# EAGLE design upromswr (EAGLE 9.6.1)
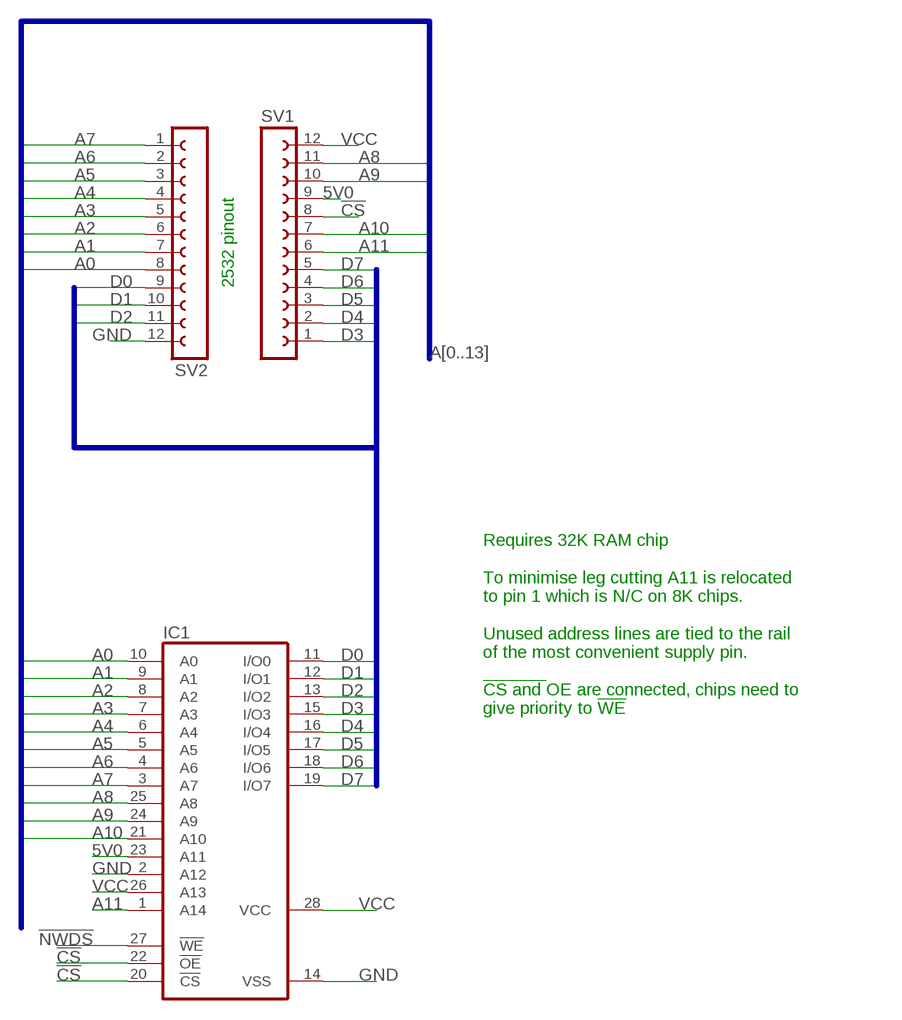
[diagram p0: schematic, sheet 1]

## Parts
IC1  62256P  [DIL28-6]
SV1  FE12-1  [FE12]
SV2  FE12-1  [FE12]

## Nets
5V0: IC1.23(A11) SV1.9
!CS: IC1.20(!CS) IC1.22(!OE) SV1.8
!NWDS: IC1.27(!WE)
A0: IC1.10(A0) SV2.8
A1: IC1.9(A1) SV2.7
A2: IC1.8(A2) SV2.6
A3: IC1.7(A3) SV2.5
A4: IC1.6(A4) SV2.4
A5: IC1.5(A5) SV2.3
A6: IC1.4(A6) SV2.2
A7: IC1.3(A7) SV2.1
A8: IC1.25(A8) SV1.11
A9: IC1.24(A9) SV1.10
A10: IC1.21(A10) SV1.7
A11: IC1.1(A14) SV1.6
D0: IC1.11(I/O0) SV2.9
D1: IC1.12(I/O1) SV2.10
D2: IC1.13(I/O2) SV2.11
D3: IC1.15(I/O3) SV1.1
D4: IC1.16(I/O4) SV1.2
D5: IC1.17(I/O5) SV1.3
D6: IC1.18(I/O6) SV1.4
D7: IC1.19(I/O7) SV1.5
GND: IC1.2(A12) IC1.14(VSS) SV2.12
VCC: IC1.26(A13) IC1.28(VCC) SV1.12

## Buses
A[0..13]
D[0..7]

## Notes on the sheet
- 2532 pinout
- Requires 32K RAM chip
  
  To minimise leg cutting A11 is relocated
  to pin 1 which is N/C on 8K chips.
  
  Unused address lines are tied to the rail
  of the most convenient supply pin.
  
  !CS and !OE are connected, chips need to
  give priority to !WE

## Library data of the parts
IC1 = memory-hitachi:62256P: MEMORY; OC_FARNELL: unknown; OC_NEWARK: unknown
SV1 SV2 = con-lsta:FE12-1: FEMALE HEADER; OC_FARNELL: unknown; OC_NEWARK: unknown

## Board
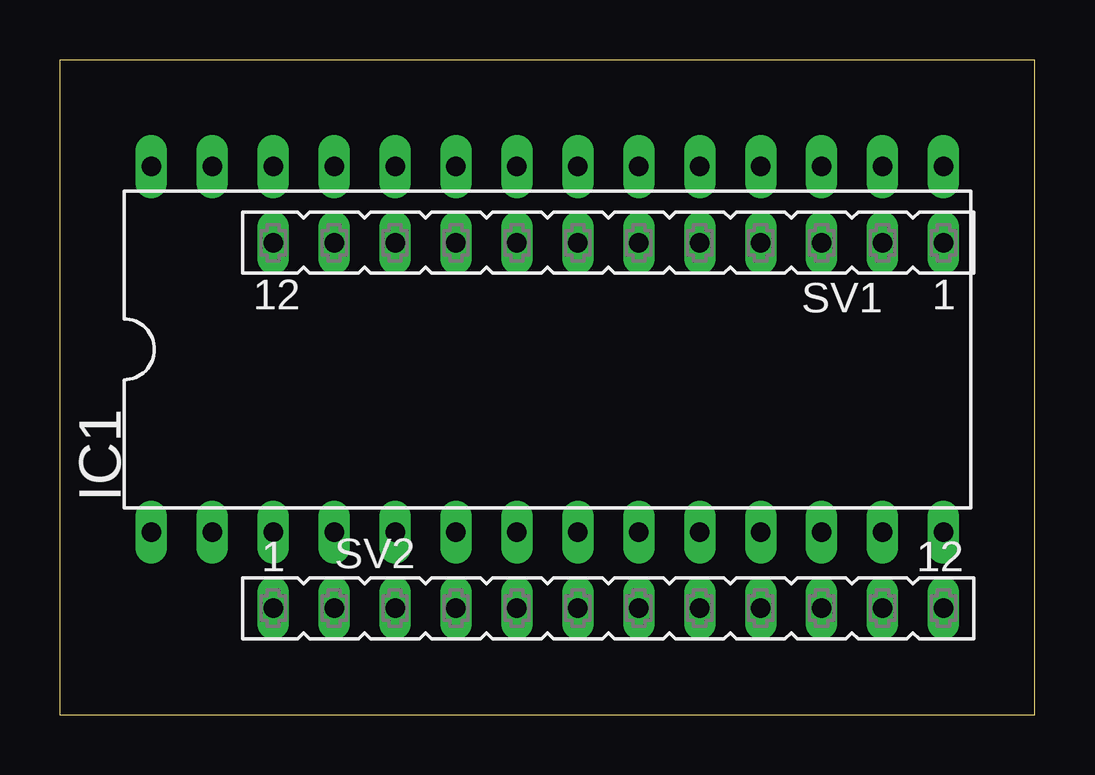
[diagram p1: board, top side]
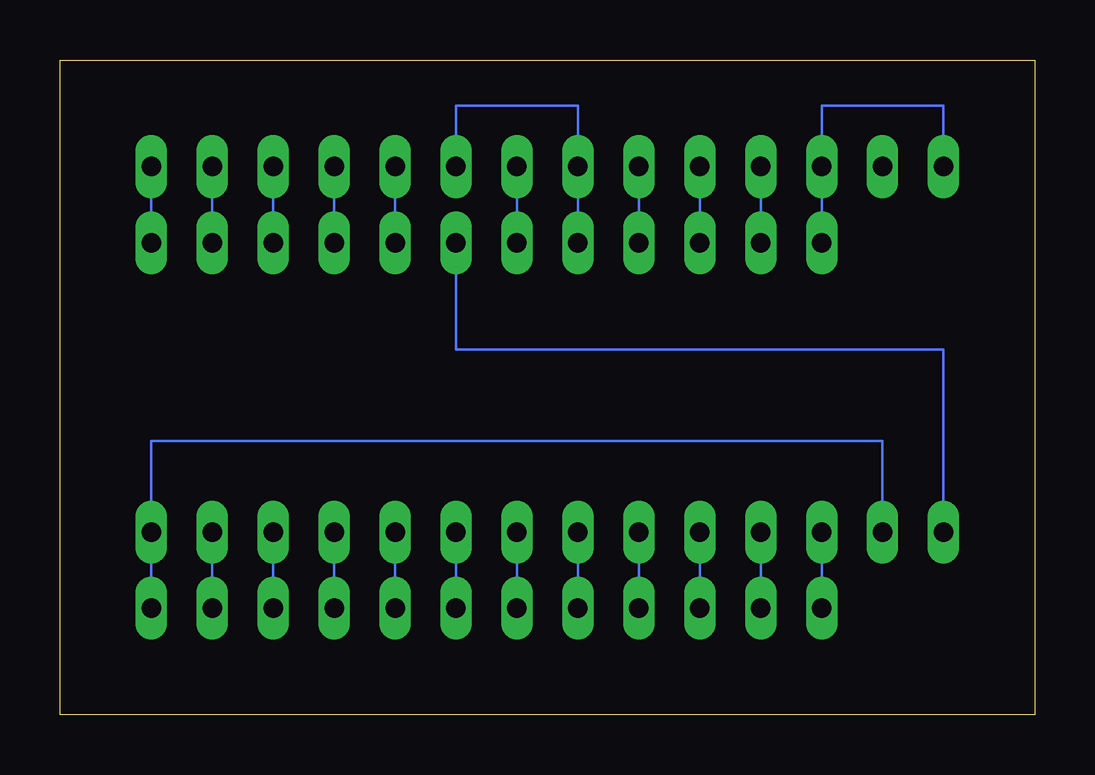
[diagram p2: board, bottom side, seen from below]

Size 40.64 x 27.3 mm. Coordinates in mm from the lower left corner, seen from the top.
Outline: 0,0 40.64,0 40.64,27.3 0,27.3 0,0
Copper layers (1*16): Top 0.035mm / dielectric 1.5mm / Bottom 0.035mm
Design rules "default": minimum track width 6mil, minimum drill 0.35mm, track to track 6mil, track to pad 6mil, pad to pad 6mil, via to via 6mil, smd to smd 6mil, copper to edge 40mil, drill to drill 6mil, minimum pad ring 10mil, minimum via ring 8mil, stop-mask expansion 4mil, vias tented up to drill 0mil, thermal gap 10mil

### Footprints (pad centres in the part's own frame; a part is rotated, then mirrored left to right if it is on the bottom)
DIL28-6 = drill 0.813 long: 1 -16.51,-7.62; 2 -13.97,-7.62; 3 -11.43,-7.62; 4 -8.89,-7.62; 5 -6.35,-7.62; 6 -3.81,-7.62; 7 -1.27,-7.62; 8 1.27,-7.62; 9 3.81,-7.62; 10 6.35,-7.62; 11 8.89,-7.62; 12 11.43,-7.62; 13 13.97,-7.62; 14 16.51,-7.62; 15 16.51,7.62; 16 13.97,7.62; 17 11.43,7.62; 18 8.89,7.62; 19 6.35,7.62; 20 3.81,7.62; 21 1.27,7.62; 22 -1.27,7.62; 23 -3.81,7.62; 24 -6.35,7.62; 25 -8.89,7.62; 26 -11.43,7.62; 27 -13.97,7.62; 28 -16.51,7.62
FE12 = drill 0.813 long: 1 -13.97,0; 2 -11.43,0; 3 -8.89,0; 4 -6.35,0; 5 -3.81,0; 6 -1.27,0; 7 1.27,0; 8 3.81,0; 9 6.35,0; 10 8.89,0; 11 11.43,0; 12 13.97,0

### Placement (x,y rotation side)
IC1  20.32,15.24 0 top
SV1  22.86,19.69 180 top
SV2  22.86,4.44 0 top

### Tracks (layer width: path | path; a pad name or v marks a point on that pad's centre or on a via)
5V0
  Bottom 0.102: IC1.23 SV1.9
!CS
  Bottom 0.102: SV1.8 IC1.22 | IC1.22 19.05,23.44 | IC1.22 19.05,25.4 24.13,25.4 IC1.20
A0
  Bottom 0.102: SV2.8 IC1.10
A1
  Bottom 0.102: IC1.9 SV2.7
A2
  Bottom 0.102: SV2.6 IC1.8
A3
  Bottom 0.102: IC1.7 SV2.5
A4
  Bottom 0.102: IC1.6 SV2.4
A5
  Bottom 0.102: IC1.5 SV2.3
A6
  Bottom 0.102: IC1.4 SV2.2
A7
  Bottom 0.102: IC1.3 SV2.1
A8
  Bottom 0.102: SV1.11 IC1.25
A9
  Bottom 0.102: SV1.10 IC1.24
A10
  Bottom 0.102: SV1.7 IC1.21 21.59,23.34
A11
  Bottom 0.102: IC1.1 3.81,15.24 24.13,15.24 SV1.6
D0
  Bottom 0.102: IC1.11 SV2.9
D1
  Bottom 0.102: SV2.10 IC1.12
D2
  Bottom 0.102: SV2.11 IC1.13
D3
  Bottom 0.102: SV1.1 IC1.15
D4
  Bottom 0.102: SV1.2 IC1.16
D5
  Bottom 0.102: SV1.3 IC1.17
D6
  Bottom 0.102: SV1.4 IC1.18
D7
  Bottom 0.102: SV1.5 IC1.19
GND
  Bottom 0.102: SV2.12 IC1.14 36.83,11.43 6.35,11.43 IC1.2
VCC
  Bottom 0.102: SV1.12 IC1.26 8.89,25.4 3.81,25.4 IC1.28